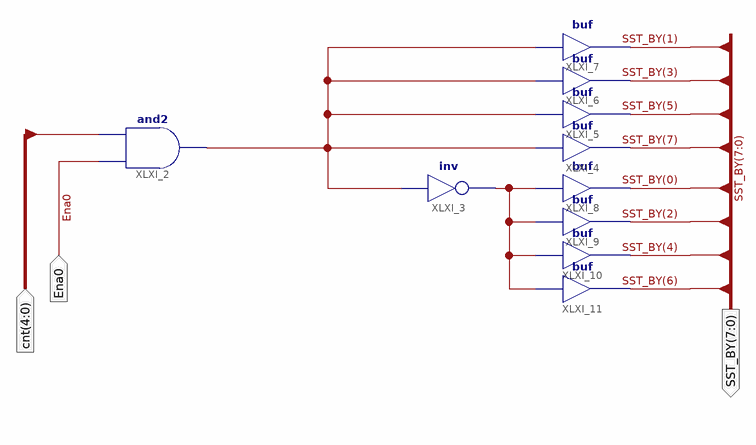
[diagram p0: schematic sheet 1]
// Xilinx ISE schematic ST_BY.sch (spartan6) as structural Verilog: 10 symbols, 3 ports
module ST_BY (
  input  Ena0,
  input  [4:0] cnt,
  output [7:0] SST_BY
);

  wire XLXN_6, XLXN_16, XLXN_22;

  not XLXI_3 (XLXN_22, XLXN_16);
  buf XLXI_5 (SST_BY[5], XLXN_16);
  buf XLXI_6 (SST_BY[3], XLXN_16);
  buf XLXI_7 (SST_BY[1], XLXN_16);
  buf XLXI_8 (SST_BY[0], XLXN_22);
  buf XLXI_9 (SST_BY[2], XLXN_22);
  buf XLXI_10 (SST_BY[4], XLXN_22);
  buf XLXI_11 (SST_BY[6], XLXN_22);
  buf XLXI_4 (SST_BY[7], XLXN_16);
  and XLXI_2 (XLXN_16, Ena0, XLXN_6);
endmodule
